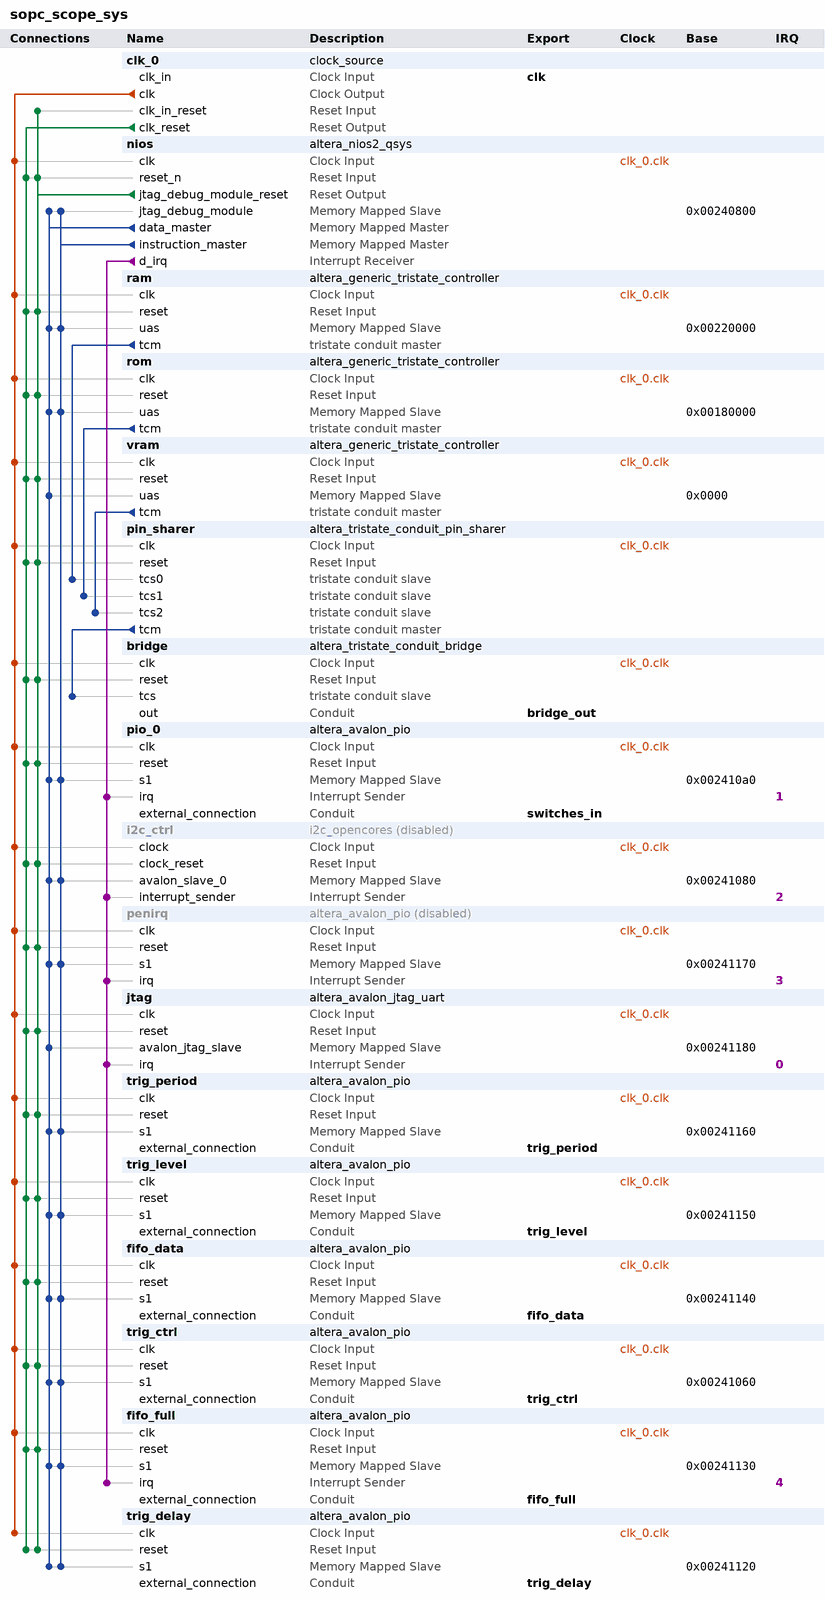
[diagram p0: system contents]
# Platform Designer (Qsys) system sopc_scope_sys, Cyclone III EP3C25Q240C8
# Parameters at their usual value, and those the tool derives, are not listed.
package require -exact qsys 13.1
create_system sopc_scope_sys
set_project_property DEVICE_FAMILY {Cyclone III}
set_project_property DEVICE EP3C25Q240C8

add_instance clk_0 clock_source 13.1
set_instance_parameter_value clk_0 clockFrequency 50000000

add_instance nios altera_nios2_qsys 13.1
set_instance_parameter_value nios resetSlave rom.uas
set_instance_parameter_value nios mmu_TLBMissExcSlave None
set_instance_parameter_value nios exceptionSlave rom.uas
set_instance_parameter_value nios breakSlave nios.jtag_debug_module
set_instance_parameter_value nios impl Fast
set_instance_parameter_value nios icache_size 4096

add_instance ram altera_generic_tristate_controller 13.1
set_instance_parameter_value ram TCM_ADDRESS_W 17
set_instance_parameter_value ram TCM_DATA_W 8
set_instance_parameter_value ram TCM_BYTEENABLE_W 1
set_instance_parameter_value ram TCM_READ_WAIT 3
set_instance_parameter_value ram TCM_WRITE_WAIT 3
set_instance_parameter_value ram TCM_SETUP_WAIT 0
set_instance_parameter_value ram TCM_DATA_HOLD 1
set_instance_parameter_value ram TCM_MAX_PENDING_READ_TRANSACTIONS 1
set_instance_parameter_value ram TCM_TURNAROUND_TIME 2
set_instance_parameter_value ram TCM_TIMING_UNITS 1
set_instance_parameter_value ram TCM_READLATENCY 2
set_instance_parameter_value ram TCM_SYMBOLS_PER_WORD 1
set_instance_parameter_value ram USE_READ 1
set_instance_parameter_value ram USE_BEGINTRANSFER 0
set_instance_parameter_value ram USE_BYTEENABLE 0
set_instance_parameter_value ram USE_OUTPUTENABLE 0
set_instance_parameter_value ram ACTIVE_LOW_READ 0
set_instance_parameter_value ram ACTIVE_LOW_BYTEENABLE 0
set_instance_parameter_value ram ACTIVE_LOW_OUTPUTENABLE 0
set_instance_parameter_value ram ACTIVE_LOW_BEGINTRANSFER 0
set_instance_parameter_value ram CHIPSELECT_THROUGH_READLATENCY 0
set_instance_parameter_value ram MODULE_ASSIGNMENT_KEYS embeddedsw.configuration.hwClassnameDriverSupportList
set_instance_parameter_value ram MODULE_ASSIGNMENT_VALUES "altera_avalon_lan91c111\\,altera_avalon_cfi_flash"
set_instance_parameter_value ram INTERFACE_ASSIGNMENT_KEYS embeddedsw.CMacro.SIZE
set_instance_parameter_value ram INTERFACE_ASSIGNMENT_VALUES 131072

add_instance rom altera_generic_tristate_controller 13.1
set_instance_parameter_value rom TCM_ADDRESS_W 19
set_instance_parameter_value rom TCM_DATA_W 8
set_instance_parameter_value rom TCM_BYTEENABLE_W 1
set_instance_parameter_value rom TCM_READ_WAIT 5
set_instance_parameter_value rom TCM_WRITE_WAIT 0
set_instance_parameter_value rom TCM_SETUP_WAIT 0
set_instance_parameter_value rom TCM_DATA_HOLD 0
set_instance_parameter_value rom TCM_MAX_PENDING_READ_TRANSACTIONS 1
set_instance_parameter_value rom TCM_TURNAROUND_TIME 2
set_instance_parameter_value rom TCM_TIMING_UNITS 1
set_instance_parameter_value rom TCM_READLATENCY 2
set_instance_parameter_value rom TCM_SYMBOLS_PER_WORD 1
set_instance_parameter_value rom USE_READ 1
set_instance_parameter_value rom USE_WRITE 0
set_instance_parameter_value rom USE_BEGINTRANSFER 0
set_instance_parameter_value rom USE_BYTEENABLE 0
set_instance_parameter_value rom USE_OUTPUTENABLE 0
set_instance_parameter_value rom ACTIVE_LOW_READ 0
set_instance_parameter_value rom ACTIVE_LOW_WRITE 0
set_instance_parameter_value rom ACTIVE_LOW_BYTEENABLE 0
set_instance_parameter_value rom ACTIVE_LOW_OUTPUTENABLE 0
set_instance_parameter_value rom ACTIVE_LOW_BEGINTRANSFER 0
set_instance_parameter_value rom CHIPSELECT_THROUGH_READLATENCY 0
set_instance_parameter_value rom MODULE_ASSIGNMENT_KEYS embeddedsw.configuration.hwClassnameDriverSupportList
set_instance_parameter_value rom MODULE_ASSIGNMENT_VALUES "altera_avalon_lan91c111\\,altera_avalon_cfi_flash"

add_instance vram altera_generic_tristate_controller 13.1
set_instance_parameter_value vram TCM_ADDRESS_W 20
set_instance_parameter_value vram TCM_DATA_W 32
set_instance_parameter_value vram TCM_BYTEENABLE_W 4
set_instance_parameter_value vram TCM_READ_WAIT 0
set_instance_parameter_value vram TCM_WRITE_WAIT 0
set_instance_parameter_value vram TCM_SETUP_WAIT 0
set_instance_parameter_value vram TCM_DATA_HOLD 0
set_instance_parameter_value vram TCM_MAX_PENDING_READ_TRANSACTIONS 1
set_instance_parameter_value vram TCM_TURNAROUND_TIME 2
set_instance_parameter_value vram TCM_TIMING_UNITS 1
set_instance_parameter_value vram TCM_READLATENCY 2
set_instance_parameter_value vram TCM_SYMBOLS_PER_WORD 4
set_instance_parameter_value vram USE_READ 0
set_instance_parameter_value vram USE_BEGINTRANSFER 0
set_instance_parameter_value vram USE_BYTEENABLE 0
set_instance_parameter_value vram USE_WAITREQUEST 1
set_instance_parameter_value vram USE_OUTPUTENABLE 0
set_instance_parameter_value vram ACTIVE_LOW_READ 0
set_instance_parameter_value vram ACTIVE_LOW_BYTEENABLE 0
set_instance_parameter_value vram ACTIVE_LOW_OUTPUTENABLE 0
set_instance_parameter_value vram ACTIVE_LOW_BEGINTRANSFER 0
set_instance_parameter_value vram CHIPSELECT_THROUGH_READLATENCY 0
set_instance_parameter_value vram MODULE_ASSIGNMENT_KEYS embeddedsw.configuration.hwClassnameDriverSupportList
set_instance_parameter_value vram MODULE_ASSIGNMENT_VALUES "altera_avalon_lan91c111\\,altera_avalon_cfi_flash"
set_instance_parameter_value vram INTERFACE_ASSIGNMENT_KEYS embeddedsw.CMacro.SIZE
set_instance_parameter_value vram INTERFACE_ASSIGNMENT_VALUES 1048576

add_instance pin_sharer altera_tristate_conduit_pin_sharer 13.1
set_instance_parameter_value pin_sharer NUM_INTERFACES 3
set_instance_parameter_value pin_sharer MODULE_ORIGIN_LIST vram.tcm,vram.tcm,vram.tcm,vram.tcm,vram.tcm,rom.tcm,rom.tcm,rom.tcm,rom.tcm,ram.tcm,ram.tcm,ram.tcm,ram.tcm,ram.tcm
set_instance_parameter_value pin_sharer SIGNAL_ORIGIN_LIST address,waitrequest,write_n,data,chipselect_n,address,read,data,chipselect_n,address,write_n,read,data,chipselect_n
set_instance_parameter_value pin_sharer SHARED_SIGNAL_LIST ,,we,data,,addr,,data,,addr,we,,data

add_instance bridge altera_tristate_conduit_bridge 13.1

add_instance pio_0 altera_avalon_pio 13.1
set_instance_parameter_value pio_0 bitClearingEdgeCapReg true
set_instance_parameter_value pio_0 bitModifyingOutReg true
set_instance_parameter_value pio_0 captureEdge true
set_instance_parameter_value pio_0 direction Input
set_instance_parameter_value pio_0 edgeType FALLING
set_instance_parameter_value pio_0 generateIRQ true
set_instance_parameter_value pio_0 irqType EDGE
set_instance_parameter_value pio_0 width 6

add_instance i2c_ctrl i2c_opencores 13.0
set_instance_property i2c_ctrl ENABLED false

add_instance penirq altera_avalon_pio 13.1
set_instance_property penirq ENABLED false
set_instance_parameter_value penirq captureEdge true
set_instance_parameter_value penirq direction Input
set_instance_parameter_value penirq edgeType FALLING
set_instance_parameter_value penirq generateIRQ true
set_instance_parameter_value penirq irqType EDGE
set_instance_parameter_value penirq width 1

add_instance jtag altera_avalon_jtag_uart 13.1
set_instance_parameter_value jtag simInteractiveOptions NO_INTERACTIVE_WINDOWS

add_instance trig_period altera_avalon_pio 13.1
set_instance_parameter_value trig_period direction Output
set_instance_parameter_value trig_period resetValue 1
set_instance_parameter_value trig_period width 32

add_instance trig_level altera_avalon_pio 13.1
set_instance_parameter_value trig_level direction Output
set_instance_parameter_value trig_level width 8

add_instance fifo_data altera_avalon_pio 13.1
set_instance_parameter_value fifo_data direction Input
set_instance_parameter_value fifo_data width 8

add_instance trig_ctrl altera_avalon_pio 13.1
set_instance_parameter_value trig_ctrl bitModifyingOutReg true
set_instance_parameter_value trig_ctrl direction Output
set_instance_parameter_value trig_ctrl resetValue 3
set_instance_parameter_value trig_ctrl width 5

add_instance fifo_full altera_avalon_pio 13.1
set_instance_parameter_value fifo_full captureEdge true
set_instance_parameter_value fifo_full direction Input
set_instance_parameter_value fifo_full generateIRQ true
set_instance_parameter_value fifo_full irqType EDGE
set_instance_parameter_value fifo_full width 1

add_instance trig_delay altera_avalon_pio 13.1
set_instance_parameter_value trig_delay direction Output
set_instance_parameter_value trig_delay resetValue 1
set_instance_parameter_value trig_delay width 32

# connections
add_connection clk_0.clk bridge.clk clock
add_connection clk_0.clk fifo_data.clk clock
add_connection clk_0.clk fifo_full.clk clock
add_connection clk_0.clk i2c_ctrl.clock clock
add_connection clk_0.clk jtag.clk clock
add_connection clk_0.clk nios.clk clock
add_connection clk_0.clk penirq.clk clock
add_connection clk_0.clk pin_sharer.clk clock
add_connection clk_0.clk pio_0.clk clock
add_connection clk_0.clk ram.clk clock
add_connection clk_0.clk rom.clk clock
add_connection clk_0.clk trig_ctrl.clk clock
add_connection clk_0.clk trig_delay.clk clock
add_connection clk_0.clk trig_level.clk clock
add_connection clk_0.clk trig_period.clk clock
add_connection clk_0.clk vram.clk clock
add_connection clk_0.clk_reset bridge.reset reset
add_connection clk_0.clk_reset fifo_data.reset reset
add_connection clk_0.clk_reset fifo_full.reset reset
add_connection clk_0.clk_reset i2c_ctrl.clock_reset reset
add_connection clk_0.clk_reset jtag.reset reset
add_connection clk_0.clk_reset nios.reset_n reset
add_connection clk_0.clk_reset penirq.reset reset
add_connection clk_0.clk_reset pin_sharer.reset reset
add_connection clk_0.clk_reset pio_0.reset reset
add_connection clk_0.clk_reset ram.reset reset
add_connection clk_0.clk_reset rom.reset reset
add_connection clk_0.clk_reset trig_ctrl.reset reset
add_connection clk_0.clk_reset trig_delay.reset reset
add_connection clk_0.clk_reset trig_level.reset reset
add_connection clk_0.clk_reset trig_period.reset reset
add_connection clk_0.clk_reset vram.reset reset
add_connection nios.jtag_debug_module_reset bridge.reset reset
add_connection nios.jtag_debug_module_reset clk_0.clk_in_reset reset
add_connection nios.jtag_debug_module_reset fifo_data.reset reset
add_connection nios.jtag_debug_module_reset fifo_full.reset reset
add_connection nios.jtag_debug_module_reset i2c_ctrl.clock_reset reset
add_connection nios.jtag_debug_module_reset jtag.reset reset
add_connection nios.jtag_debug_module_reset nios.reset_n reset
add_connection nios.jtag_debug_module_reset penirq.reset reset
add_connection nios.jtag_debug_module_reset pin_sharer.reset reset
add_connection nios.jtag_debug_module_reset pio_0.reset reset
add_connection nios.jtag_debug_module_reset ram.reset reset
add_connection nios.jtag_debug_module_reset rom.reset reset
add_connection nios.jtag_debug_module_reset trig_ctrl.reset reset
add_connection nios.jtag_debug_module_reset trig_delay.reset reset
add_connection nios.jtag_debug_module_reset trig_level.reset reset
add_connection nios.jtag_debug_module_reset trig_period.reset reset
add_connection nios.jtag_debug_module_reset vram.reset reset
add_connection nios.data_master fifo_data.s1 avalon
set_connection_parameter_value nios.data_master/fifo_data.s1 baseAddress 0x00241140
add_connection nios.data_master fifo_full.s1 avalon
set_connection_parameter_value nios.data_master/fifo_full.s1 baseAddress 0x00241130
add_connection nios.data_master i2c_ctrl.avalon_slave_0 avalon
set_connection_parameter_value nios.data_master/i2c_ctrl.avalon_slave_0 baseAddress 0x00241080
add_connection nios.data_master jtag.avalon_jtag_slave avalon
set_connection_parameter_value nios.data_master/jtag.avalon_jtag_slave baseAddress 0x00241180
add_connection nios.data_master nios.jtag_debug_module avalon
set_connection_parameter_value nios.data_master/nios.jtag_debug_module baseAddress 0x00240800
add_connection nios.data_master penirq.s1 avalon
set_connection_parameter_value nios.data_master/penirq.s1 baseAddress 0x00241170
add_connection nios.data_master pio_0.s1 avalon
set_connection_parameter_value nios.data_master/pio_0.s1 baseAddress 0x002410a0
add_connection nios.data_master ram.uas avalon
set_connection_parameter_value nios.data_master/ram.uas baseAddress 0x00220000
add_connection nios.data_master rom.uas avalon
set_connection_parameter_value nios.data_master/rom.uas baseAddress 0x00180000
add_connection nios.data_master trig_ctrl.s1 avalon
set_connection_parameter_value nios.data_master/trig_ctrl.s1 baseAddress 0x00241060
add_connection nios.data_master trig_delay.s1 avalon
set_connection_parameter_value nios.data_master/trig_delay.s1 baseAddress 0x00241120
add_connection nios.data_master trig_level.s1 avalon
set_connection_parameter_value nios.data_master/trig_level.s1 baseAddress 0x00241150
add_connection nios.data_master trig_period.s1 avalon
set_connection_parameter_value nios.data_master/trig_period.s1 baseAddress 0x00241160
add_connection nios.data_master vram.uas avalon
set_connection_parameter_value nios.data_master/vram.uas baseAddress 0x0000
add_connection nios.instruction_master fifo_data.s1 avalon
set_connection_parameter_value nios.instruction_master/fifo_data.s1 baseAddress 0x00241140
add_connection nios.instruction_master fifo_full.s1 avalon
set_connection_parameter_value nios.instruction_master/fifo_full.s1 baseAddress 0x00241130
add_connection nios.instruction_master i2c_ctrl.avalon_slave_0 avalon
set_connection_parameter_value nios.instruction_master/i2c_ctrl.avalon_slave_0 baseAddress 0x00241080
add_connection nios.instruction_master nios.jtag_debug_module avalon
set_connection_parameter_value nios.instruction_master/nios.jtag_debug_module baseAddress 0x00240800
add_connection nios.instruction_master penirq.s1 avalon
set_connection_parameter_value nios.instruction_master/penirq.s1 baseAddress 0x00241170
add_connection nios.instruction_master pio_0.s1 avalon
set_connection_parameter_value nios.instruction_master/pio_0.s1 baseAddress 0x002410a0
add_connection nios.instruction_master ram.uas avalon
set_connection_parameter_value nios.instruction_master/ram.uas baseAddress 0x00220000
add_connection nios.instruction_master rom.uas avalon
set_connection_parameter_value nios.instruction_master/rom.uas baseAddress 0x00180000
add_connection nios.instruction_master trig_ctrl.s1 avalon
set_connection_parameter_value nios.instruction_master/trig_ctrl.s1 baseAddress 0x00241060
add_connection nios.instruction_master trig_delay.s1 avalon
set_connection_parameter_value nios.instruction_master/trig_delay.s1 baseAddress 0x00241120
add_connection nios.instruction_master trig_level.s1 avalon
set_connection_parameter_value nios.instruction_master/trig_level.s1 baseAddress 0x00241150
add_connection nios.instruction_master trig_period.s1 avalon
set_connection_parameter_value nios.instruction_master/trig_period.s1 baseAddress 0x00241160
add_connection nios.d_irq fifo_full.irq interrupt
set_connection_parameter_value nios.d_irq/fifo_full.irq irqNumber 4
add_connection nios.d_irq i2c_ctrl.interrupt_sender interrupt
set_connection_parameter_value nios.d_irq/i2c_ctrl.interrupt_sender irqNumber 2
add_connection nios.d_irq jtag.irq interrupt
set_connection_parameter_value nios.d_irq/jtag.irq irqNumber 0
add_connection nios.d_irq penirq.irq interrupt
set_connection_parameter_value nios.d_irq/penirq.irq irqNumber 3
add_connection nios.d_irq pio_0.irq interrupt
set_connection_parameter_value nios.d_irq/pio_0.irq irqNumber 1
add_connection pin_sharer.tcm bridge.tcs tristate_conduit
add_connection ram.tcm pin_sharer.tcs0 tristate_conduit
add_connection rom.tcm pin_sharer.tcs1 tristate_conduit
add_connection vram.tcm pin_sharer.tcs2 tristate_conduit

# exported interfaces
add_interface clk clock sink
set_interface_property clk EXPORT_OF clk_0.clk_in
add_interface bridge_out conduit end
set_interface_property bridge_out EXPORT_OF bridge.out
add_interface switches_in conduit end
set_interface_property switches_in EXPORT_OF pio_0.external_connection
add_interface fifo_full conduit end
set_interface_property fifo_full EXPORT_OF fifo_full.external_connection
add_interface trig_ctrl conduit end
set_interface_property trig_ctrl EXPORT_OF trig_ctrl.external_connection
add_interface fifo_data conduit end
set_interface_property fifo_data EXPORT_OF fifo_data.external_connection
add_interface trig_level conduit end
set_interface_property trig_level EXPORT_OF trig_level.external_connection
add_interface trig_period conduit end
set_interface_property trig_period EXPORT_OF trig_period.external_connection
add_interface trig_delay conduit end
set_interface_property trig_delay EXPORT_OF trig_delay.external_connection

set_interconnect_requirement {$system} qsys_mm.clockCrossingAdapter HANDSHAKE
set_interconnect_requirement {$system} qsys_mm.maxAdditionalLatency 1
set_interconnect_requirement {$system} qsys_mm.insertDefaultSlave false

save_system sopc_scope_sys.qsys
